# EasyEDA Pro project ClockX-v1.epro

# Schematic Schematic1_1
Board Name: Board1; Create Date: 2026-02-05; Page Name: P1; Project Name: clockX-V1; Schematic Name: Schematic1; Update Date: 2026-02-05; Company: EasyEDA.com; Page Size: A4; Version: V1.0
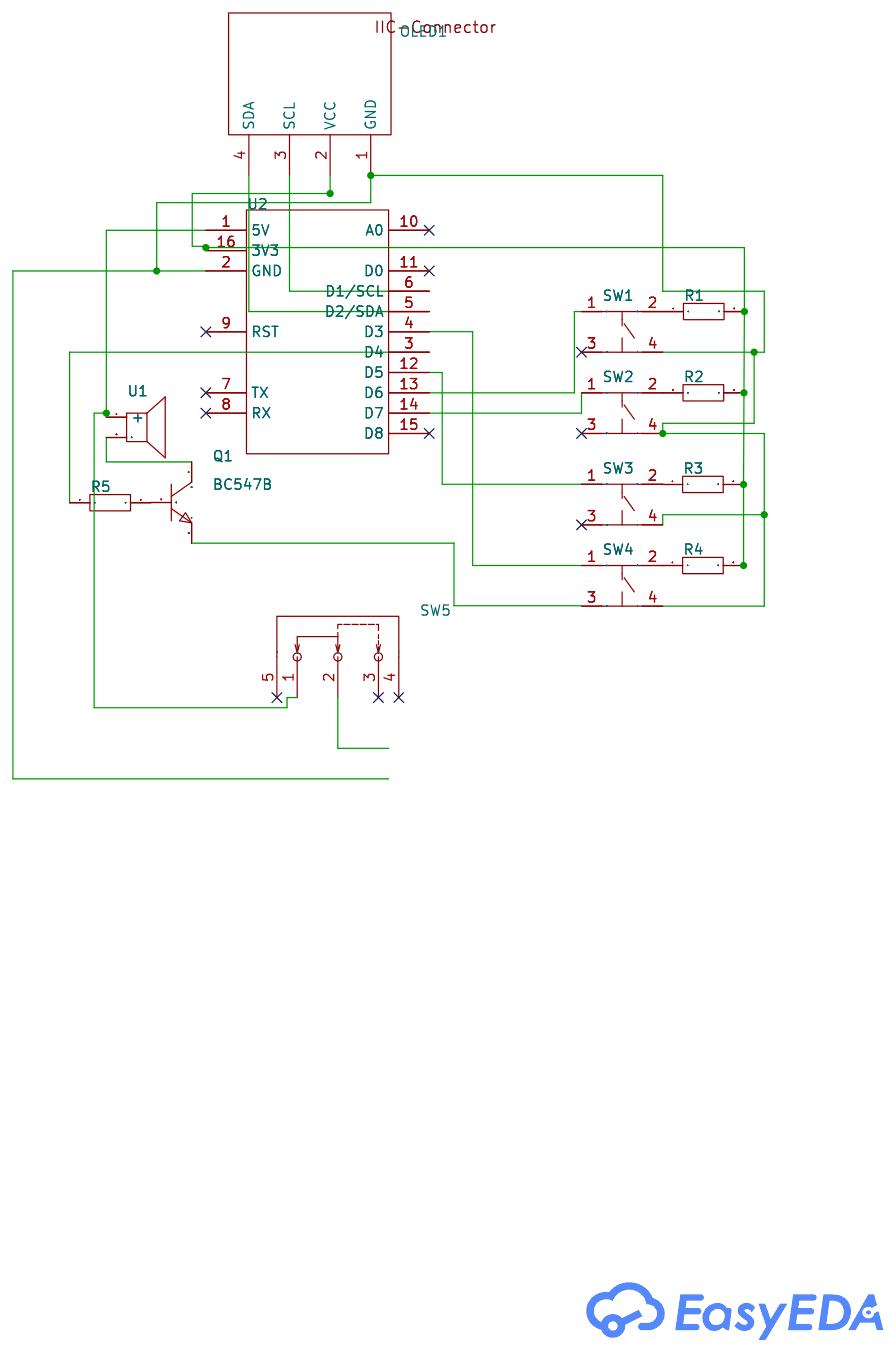
[diagram p0: schematic sheet]

## Parts
OLED1  0.96OLED_4P_MODULE_JX  [0.96OLED_4P]
Q1  BC547B  [TO-92-3_L4.9-W3.7-P1.27-L]
R1  -  [Resistor 1/8w 7mm metal film]
R2  -  [Resistor 1/8w 7mm metal film]
R3  -  [Resistor 1/8w 7mm metal film]
R4  -  [Resistor 1/8w 7mm metal film]
R5  -  [Resistor 1/8w 7mm metal film]
SW1  MLD-TS-6X6X5-J  [SW-TH_4P-L6.0-W6.0-P4.50-LS6.5]
SW2  MLD-TS-6X6X5-J  [SW-TH_4P-L6.0-W6.0-P4.50-LS6.5]
SW3  MLD-TS-6X6X5-J  [SW-TH_4P-L6.0-W6.0-P4.50-LS6.5]
SW4  MLD-TS-6X6X5-J  [SW-TH_4P-L6.0-W6.0-P4.50-LS6.5]
SW5  SK12D07VG4  [SW-TH_SK12D07VG4]
U1  _x001F_BEEF-12095  [BUZ-TH_BD12.0-P7.60-D0.6-FD]
U2  -  [WEMOS D1 MINI]

## Library data of the parts
OLED1 = 0.96OLED_4P_MODULE_JX: Supplier Part: C9900004566; Supplier Footprint: 插件; JLCPCB Part Class: Extended Part; Supplier: LCSC
Q1 = BC547B_C719806: Transistor Type: Collector Current (Ic): Collector-Emitter Breakdown Voltage (Vceo): Power Dissipation (Pd): DC Current Gain (hFE@Ic,Vce):200@2mA,5V DC Current Gain (hFE@Ic,Vce):200@2mA,5V Transition Frequency (fT):300MHz Collector Cut-Off Current (Icbo):; LCSC Part Name: 耐压:45V 电流:100mA NPN; Supplier Part: C719806; Manufacturer: onsemi(安森美); Supplier Footprint: TO-92-3; JLCPCB Part Class: Extended Part; Datasheet: https://atta.szlcsc.com/upload/public/pdf/source/20230915/4ABAAE35BBE891E62B9F2D68DC6BA32E.pdf; Supplier: LCSC; DC Current Gain (hFE@Ic,Vce): 200@2mA,5V; Transition Frequency (fT): 300MHz; Collector Cut-Off Current (Icbo): 15nA; Collector-Emitter Saturation Voltage (VCE(sat)@Ic,Ib): 600mV@5mA,100mA; Operating Temperature: -55℃~+150℃@(Tj)
R1-R5 = resistor: Supplier: LCSC; Manufacturer: UNI-ROYAL(Uniroyal Elec); Manufacturer Part: 1206W4F1002T5E; Supplier Part: C17902; Resistance: 10KΩ; JLCPCB Part Class: Basic Part; Datasheet: https://datasheet.lcsc.com/lcsc/2206010145_UNI-ROYAL-Uniroyal-Elec-1206W4F1002T5E_C17902.pdf
SW1-SW4 = MLD-TS-6X6X5-J: LCSC Part Name: 6*6*5mm 直插 轻触开关; Supplier Part: C52750873; Manufacturer: Minlenda(敏连达); Supplier Footprint: DIP-4P,6x6mm; JLCPCB Part Class: Extended Part; Datasheet: https://item.szlcsc.com/datasheet/MLD-TS-6X6X5-J/55649289.html; Supplier: LCSC
SW5 = SK12D07VG4: Circuit:SPDT Actuator Style:Rectangular Columnar Termination Style:PC Pin Switch Height:8.8mm Mounting Type:Right Angle Current Rating:500mA Voltage Rating:50V Life:5,000 cycles Operating Temperature:-25℃~+70℃ Operating Temperature:-25℃~+70℃; Supplier Part: C393937; Manufacturer: SHOU HAN(首韩); Supplier Footprint: 插件; JLCPCB Part Class: Extended Part; Datasheet: https://item.szlcsc.com/datasheet/SK12D07VG4/372549.html; Supplier: LCSC; Circuit: SPDT; Actuator Style: Rectangular Columnar; Termination Style: PC Pin; Switch Height: 8.8mm; Mounting Type: Right Angle; Current Rating: 500mA; Voltage Rating: 50V; Life: 5,000 cycles; Operating Temperature: -25℃~+70℃
U1 = _x001F_BEEF-12095: Supplier Part: C9900016030; Supplier Footprint: TMB12A05-5V; JLCPCB Part Class: Extended Part; Supplier: LCSC
U2 = WEMOS D1 MINI

## Nets
$1N1307: Q1.1(C) U1.2
$1N2199: R2.1 SW2.2
Net-(OLED1-1): OLED1.1(GND) SW1.4 SW2.4 SW3.4 SW4.4 U2.2(GND)
Net-(OLED1-2): OLED1.2(VCC) R1.2 R2.2 R3.2 R4.2 U2.16(3V3)
Net-(OLED1-3): OLED1.3(SCL) U2.6(D1/SCL)
Net-(OLED1-4): OLED1.4(SDA) U2.5(D2/SDA)
Net-(R5-1): R5.1 U2.3(D4)
Net-(SW1-1): SW1.1 U2.13(D6)
Net-(SW2-1): SW2.1 U2.14(D7)
Net-(SW5-1): SW5.1 U1.1(+) U2.1(5V)

Not connected (* = marked no-connect by the designer): Q1 2(B) 3(E); R1 1; R3 1; R4 1; R5 2; SW1 2 3*; SW2 3*; SW3 1 2 3*; SW4 1 2 3; SW5 2 3* 4* 5*; U2 4(D3) 7(TX)* 8(RX)* 9(RST)* 10(A0)* 11(D0)* 12(D5) 15(D8)*

# Board PCB1_1
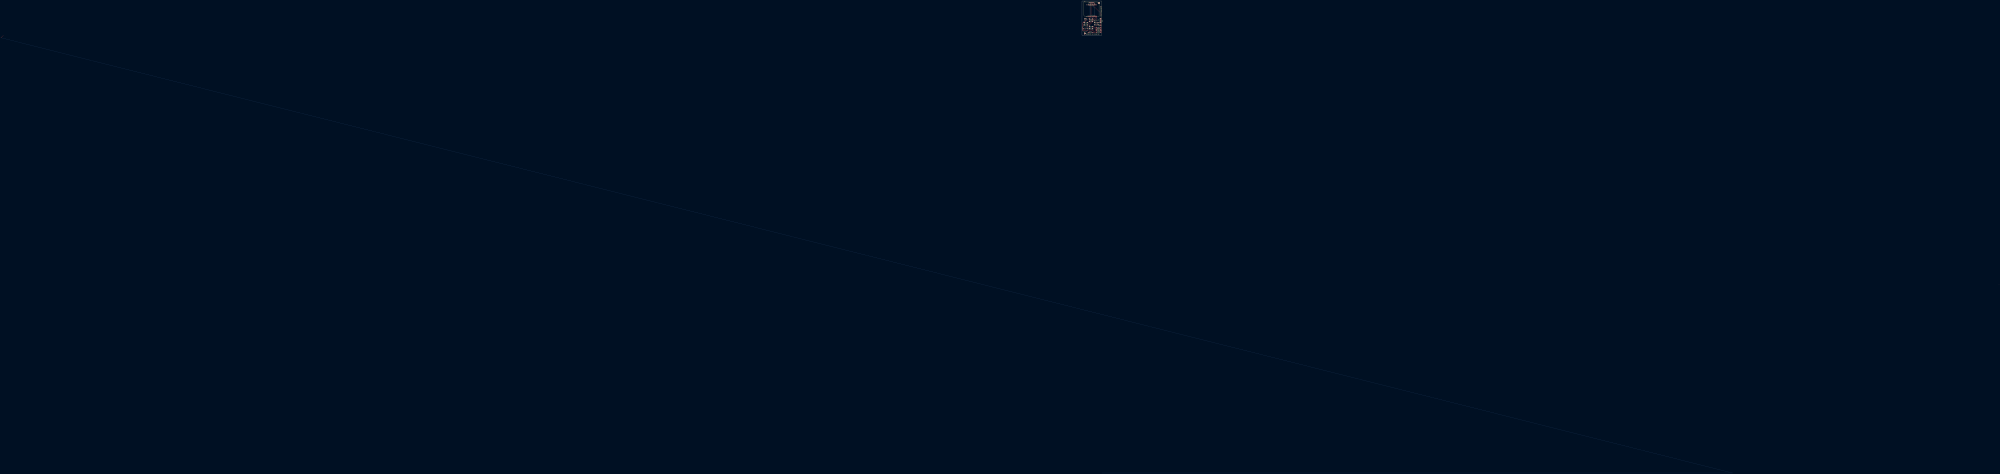
[diagram p1: board, top side]
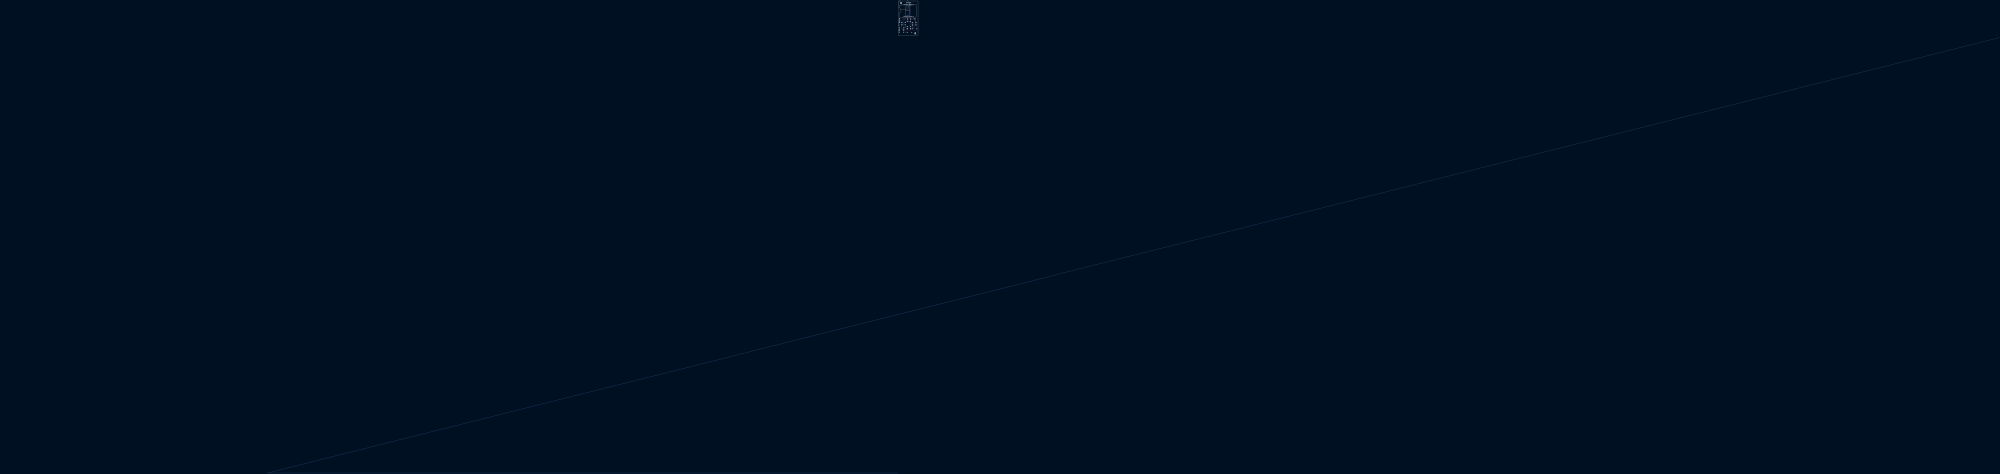
[diagram p2: board, bottom side, seen from below]

Outline 39.24 x 67.79 mm; copper layers: Top Layer, Bottom Layer. Coordinates in mm from the lower left corner of the outline.
Outline path: rectangle 0,67.79 39.24,0
Stack: Top Layer 0.035mm / Dielectric1 1.51mm FR4 er 4.5 / Bottom Layer 0.035mm

## Design rules (mm)
template: JLCPCB Capability(Two Layers Board)
spacing copperThickness1oz (default): track to track 0.102, other pairs 0.152 to 0.3
spacing copperThickness2oz: track to track 0.203, other pairs 0.152 to 0.3
track width copperThickness1oz (default): min 0.127, default 0.254, max 2.54
track width copperThickness2oz: min 0.203, default 0.254, max 2.54
differential pair differentialPair (default): width min 0.127, default 0.254, max 2.54; gap min 0.152, default 0.152
via viaSize (default): diameter min 0.5, default 0.61, max 10; hole min 0.3, default 0.305, max 6.3

## Placement (name value [footprint] x y rotation side)
NOREF  -  [Pad_e567]  5.46 3.4 0 top
NOREF#2  -  [Pad_e566]  33.78 64.36 0 top
NOREF#3  -  [Pad_e264]  37.72 21.95 0 top
NOREF#4  -  [Pad_e263]  37.72 19.53 0 top
OLED1  0.96OLED_4P_MODULE_JX  [0.96OLED_4P]  18.8 64.36 0 top
Q1  BC547B  [TO-92-3_L4.9-W3.7-P1.27-L]  6.6 32.36 180 top
R1  -  [Resistor 1/8w 7mm metal film]  28.07 14.83 0 top
R2  -  [Resistor 1/8w 7mm metal film]  28.19 11.91 0 top
R3  -  [Resistor 1/8w 7mm metal film]  28.32 8.87 0 top
R4  -  [Resistor 1/8w 7mm metal film]  28.19 5.69 0 top
R5  -  [Resistor 1/8w 7mm metal film]  12.45 5.44 0 top
SW1  MLD-TS-6X6X5-J  [SW-TH_4P-L6.0-W6.0-P4.50-LS6.5]  17.78 29.82 0 top
SW2  MLD-TS-6X6X5-J  [SW-TH_4P-L6.0-W6.0-P4.50-LS6.5]  7.24 22.45 0 top
SW3  MLD-TS-6X6X5-J  [SW-TH_4P-L6.0-W6.0-P4.50-LS6.5]  28.7 22.71 0 top
SW4  MLD-TS-6X6X5-J  [SW-TH_4P-L6.0-W6.0-P4.50-LS6.5]  18.16 14.83 0 top
SW5  SK12D07VG4  [SW-TH_SK12D07VG4]  36.7 28.93 90 top
U1  _x001F_BEEF-12095  [BUZ-TH_BD12.0-P7.60-D0.6-FD]  6.35 12.8 0 top
wemos d1 mini  -  [WEMOS D1 MINI]  27.69 60.05 180 bottom

## Footprints (pads in the part's own frame, mm; a bottom-side part is the same pattern mirrored in y, then rotated)
0.96OLED_4P
  round 1.65 hole 1: 1(-3.81,-0.002) 2(-1.27,0.002) 3(1.27,0.002) 4(3.81,0.002)
BUZ-TH_BD12.0-P7.60-D0.6-FD
  round 1.8 hole 1: 1(-3.8,0) 2(3.8,0)
Pad_e263
  round 1.524 hole 0.003: 1(0,0)
Pad_e264
  round 1.524 hole 0.003: 2(0,0)
Pad_e566
  round 3.1 hole 3.1: 1(0,0)
Pad_e567
  round 3.1 hole 3.1: 2(0,0)
Resistor 1/8w 7mm metal film
  round 2 hole 0.9: 1(0,0) 2(9,0)
SW-TH_4P-L6.0-W6.0-P4.50-LS6.5
  round 1.8 hole 1.2: 1(-3.25,2.25) 2(3.25,2.25) 3(-3.25,-2.25) 4(3.25,-2.25)
SW-TH_SK12D07VG4
  round 1.524 hole 0.914: 1(-2,0) 2(0,0) 3(2,0)
  oval 1.4x2.2 hole 0.8x1.6: 4(4.15,0) 5(-4.15,0)
TO-92-3_L4.9-W3.7-P1.27-L
  rect 0.9x1.6 hole 0.7: 1(-1.27,0)
  oval 0.9x1.6 hole 0.7: 2(0,0) 3(1.27,0)
WEMOS D1 MINI
  round 1.524 hole 0.914: 1(0,-22.86) 2(2.54,-22.86) 3(5.08,-22.86) 4(7.62,-22.86) 5(10.16,-22.86) 6(12.7,-22.86) 7(15.24,-22.86) 8(17.78,-22.86) 9(17.78,0) 10(15.24,0) 11(12.7,0) 12(10.16,0) 13(7.62,0) 14(5.08,0) 15(2.54,0) 16(0,0)

## Nets
$1N1061: OLED1.3 wemos d1 mini.6
$1N1066: OLED1.4 wemos d1 mini.5
$1N1091: NOREF#3.2 OLED1.2 R1.2 R2.2 R3.2 R4.2 SW5.2 wemos d1 mini.16
$1N1191: SW1.1 wemos d1 mini.13
$1N1201: SW2.1 wemos d1 mini.14
$1N1207: SW3.1
$1N1214: SW4.1 wemos d1 mini.4
$1N1278: Q1.2 R5.2
$1N1282: R5.1 wemos d1 mini.3
$1N1287: Q1.3 SW4.3
$1N1307: Q1.1 U1.2
$1N1312: SW5.1 U1.1 wemos d1 mini.1
$1N2195: NOREF#4.1 OLED1.1 SW1.4 SW2.4 SW3.4 SW4.4 wemos d1 mini.2
$1N2197: R1.1 SW1.2
$1N2199: R2.1 SW2.2
$1N2201: R3.1 SW3.2 wemos d1 mini.12
$1N2203: R4.1 SW4.2

Pads without a net: NOREF 2; NOREF#2 1; SW1 3; SW2 3; SW3 3; SW5 3 4 5; wemos d1 mini 7 8 9 10 11 15

## Via types
v1: diameter 0.61, hole 0.305, Top Layer to Bottom Layer, 2 vias

## Routing (per net, layer and track width the routed paths; a pad name or vN(x,y) marks a point on that pad's centre or on a via; arc(x,y) is an arc through that point)
(no net): length 4795.2
  Top Layer w0.254: v1(-2142.32,-5.21) -2137.24,-0.13
  Bottom Layer w0.254: 39.37,-868.81 1289.05,-868.81 v1(-2142.32,-5.21)
  vias: v1(1817.37,-494.66)
$1N1061: length 37.4
  Bottom Layer w0.254: OLED1.3 18.92,63.22 16.63,63.22 16.09,63.76 16.09,64.82 15.44,65.47 14.53,65.47 13.88,64.82 13.88,63.91 16.03,61.76 16.03,59.61 14.99,58.57 wemos d1 mini.6
$1N1066: length 42.9
  Bottom Layer w0.254: OLED1.4 22.61,61.52 21.56,60.48 21.56,59.61 22.61,58.57 22.61,57.25 25.5,54.35 25.5,38.3 26.19,37.62 26.19,36.75 25.58,36.14 24.71,36.14 24.11,36.75 24.11,37.77 21.11,40.77 wemos d1 mini.5
$1N1091: length 88.7
  Top Layer w0.254: wemos d1 mini.16 24.47,63.26 19.61,63.26 18.5,64.37 OLED1.2 17.46,64.3 17.46,64.17 21.37,60.26 21.37,59.55 37.64,43.29 37.64,34.95 37.76,34.82 37.76,33.8 38.08,33.49 38.08,32.68 37.76,32.36 37.76,25.5 38.08,25.19 38.08,24.38 36.51,22.81 36.51,12.34 37,11.85 37.13,11.85 R2.2 R4.2
  Bottom Layer w0.254: NOREF#3.2 37.85,22.07 37.85,23.55 37.95,23.65 37.95,24.25 38.08,24.38 38.08,25.19 37.95,25.31 37.95,28.64 37.29,29.31 37.03,29.31
$1N1191: length 30.8
  Top Layer w0.254: SW1.1 19.05,36.59 19.05,36.73 19.02,36.75 19.02,37.62 19.05,37.64 19.05,59.87 19.23,60.05 wemos d1 mini.13
$1N1201: length 70.4
  Top Layer w0.254: wemos d1 mini.14 22.79,60.05 24.94,62.19 26.64,60.48 26.64,59.61 27.25,59 28.12,59 28.73,59.61 28.73,60.48 28.12,61.09 27.15,61.09 24.62,63.62 24,63.62 23.71,63.91 23.71,64.82 23.06,65.47 17.07,65.47 16.42,64.82 16.42,37.14 SW2.1
$1N1214: length 54.3
  Bottom Layer w0.254: SW4.1 14.91,14.25 16.09,13.07 16.09,12.1 15.4,11.41 15.37,11.41 14.73,10.77 14.03,10.77 5.52,19.28 5.52,30.79 4.61,31.71 4.61,33.01 5.03,33.44 8.44,33.44 10.99,30.89 15.02,30.89 20.07,35.94 wemos d1 mini.4
$1N1278: length 55.6
  Top Layer w0.254: Q1.2 6.6,29.49 0.94,23.83 0.94,9.57 2.17,8.35 3.44,8.35 4.62,9.53 9.09,9.53 9.92,8.7 21.99,8.7 25.09,5.6 21.61,5.6 R5.2
$1N1282: length 107.3
  Top Layer w0.254: wemos d1 mini.3 22.21,36.79 22.21,31.58 21.52,30.89 16.31,30.89 14.17,28.75 14.04,28.75 13.35,28.06 13.35,22.06 26.64,35.36 26.64,37.62 27.25,38.23 28.12,38.23 28.73,37.62 28.73,33.6 12.45,17.32 20.71,9.06 22.14,9.06 25.45,5.75 25.45,5.45 25.24,5.24 23.06,5.24 21.98,4.16 20.92,4.16 16.73,8.35 15.36,8.35 R5.1
$1N1287: length 25
  Bottom Layer w0.254: Q1.3 5.87,31.82 5.87,23.15 11.3,17.72 11.3,14 11.48,13.82 13.68,13.82 SW4.3
$1N1307: length 39.2
  Top Layer w0.254: Q1.1 7.87,29.28 4.48,25.88 3.5,25.88 1.3,23.68 1.3,9.72 2.32,8.7 3.29,8.7 4.47,9.88 10.4,9.88 10.58,10.06 10.58,11.35 10.02,11.91 10.02,12.8
$1N1312: length 57.6
  Top Layer w0.254: 1.65,12.55 2.3,12.55 2.49,12.74 ; 2.49,12.74 2.79,12.43 2.79,10.64 3.05,10.38 3.31,10.38 19.85,26.93 19.85,28.06 20.54,28.75 21.67,28.75 27.69,34.76 wemos d1 mini.1 ; 2.49,12.74 U1.1
  Bottom Layer w0.254: 27.8,37.19 28.44,37.83 28.51,37.83 ; wemos d1 mini.1 27.24,36.74 27.24,36.11 35.74,27.61 36.92,27.61 36.92,27.14 SW5.1
$1N2195: length 204.2
  Top Layer w0.254: SW4.4 21.41,15.42 20.23,16.6 20.23,17.57 20.92,18.26 21.9,18.26 26.61,13.55 34.8,13.55 35.92,12.44 35.92,11.38 36.79,10.51 36.79,10.14 36.04,9.4 36.04,8.34 36.66,7.71 36.66,6.97 35.92,6.22 35.92,5.16 36.66,4.41 37.72,4.41 38.47,5.16 38.47,6.22 37.85,6.84 37.85,7.59 38.6,8.34 38.6,9.4 37.72,10.27 37.72,10.63 38.47,11.38 38.47,12.44 37.6,13.32 37.6,13.55 38.35,14.3 38.35,15.36 37.72,15.99 NOREF#4.1
  Bottom Layer w0.254: SW2.4 10.49,23.04 9.31,24.22 9.31,25.19 10,25.88 15.53,25.88 ; 15.53,25.88 19.85,30.2 19.85,32.56 21.56,34.27 21.56,37.34 20.13,38.78 18.92,37.58 18.92,36.61 18.1,35.79 16.95,35.79 16.13,36.61 16.13,58.04 16.48,58.4 16.48,60.48 17.09,61.09 17.96,61.09 18.57,60.48 18.57,59.51 24.89,53.19 24.89,37.75 25.15,37.49 ; 15.53,25.88 16.17,25.88 17.86,27.57 SW1.4 24.84,27.57 SW3.4 29.28,20.46 SW4.4 ; 25.15,37.49 25.15,54.2 20.34,59 19.64,59 19.02,59.61 19.02,60.32 OLED1.1 ; 25.15,37.49 wemos d1 mini.2
$1N2197: length 38.3
  Top Layer w0.254: R1.1 28.07,20.4 29.08,21.42 29.08,37.76 28.26,38.58 27.11,38.58 26.29,37.76 26.04,37.76 25.58,38.23 24.71,38.23 24.11,37.62 23.65,37.62 23.04,38.23 22.17,38.23 21.56,37.62 21.56,36.75 21.03,36.22 SW1.2
$1N2199: length 25.3
  Bottom Layer w0.254: SW2.2 20.23,14.96 20.23,12.1 20.92,11.41 21.9,11.41 22.49,12 22.83,12 23.01,12.18 23.28,11.91 R2.1
$1N2201: length 68.2
  Bottom Layer w0.254: R3.1 33.13,13.67 33.13,20.95 31.95,22.13 SW3.2 31.95,25.81 23.65,34.11 23.65,37.62 23.04,38.23 21.19,38.23 20.28,39.14 19.98,39.14 18.57,37.72 18.57,36.75 17.96,36.14 17.09,36.14 16.48,36.75 16.48,37.62 17.53,38.66 wemos d1 mini.12
$1N2203: length 14.2
  Top Layer w0.254: R4.1 28.19,7.18 26.92,8.46 26.92,11.58 SW4.2

## Text on the board
Top Silkscreen Layer: Github- @sasukeop108 | designed by sivasankar | ClockX-V1 | vcc | gnd
